# EAGLE design gpio_board (EAGLE 7.6.0)
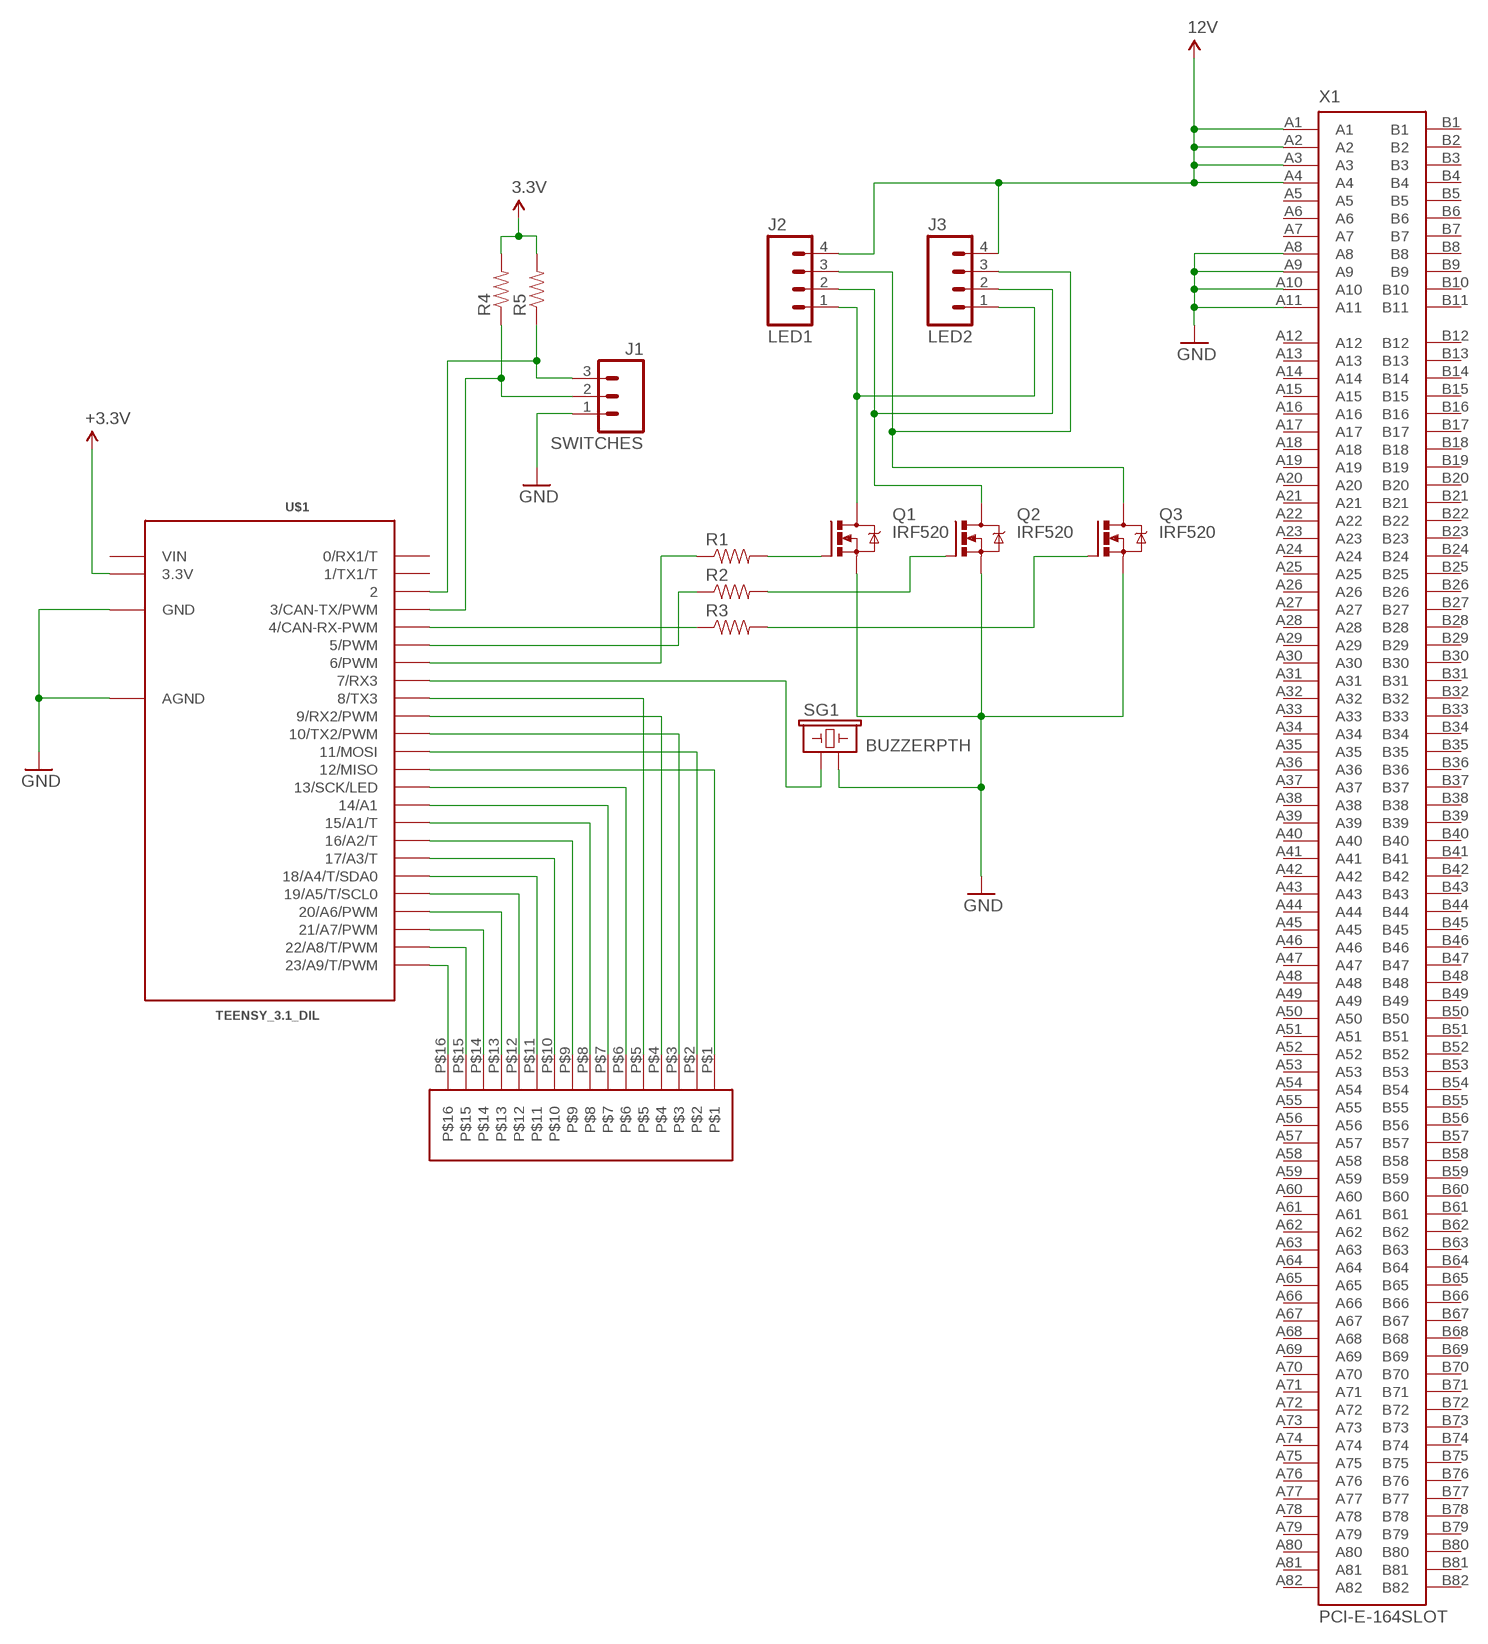
[diagram p0: schematic, sheet 1]

## Parts
J1  SWITCHES  M03PTH  [1X03]
J2  LED1  M04PTH  [1X04]
J3  LED2  M04PTH  [1X04]
Q1  IRF520  [TO220BV]
Q2  IRF520  [TO220BV]
Q3  IRF520  [TO220BV]
R1  RESISTOREZ  [AXIAL-0.3EZ]
R2  RESISTOREZ  [AXIAL-0.3EZ]
R3  RESISTOREZ  [AXIAL-0.3EZ]
R4  RESISTOREZ  [AXIAL-0.3EZ]
R5  RESISTOREZ  [AXIAL-0.3EZ]
SG1  BUZZERPTH  [BUZZER-12MM]
U$1  TEENSY_3.1_DIL  [TEENSY3-DIL]
U$2  PROTO_GRID  [PROTO_GRID16]
X1  PCI-E-164SLOT  [PCI-E_SLOT]

## Nets
3.3V: R4.P$2 R5.P$2
GND: J1.1 Q1.S Q2.S Q3.S SG1.- U$1.AGND U$1.GND X1.A8 X1.A9 X1.A10 X1.A11
N$1: Q1.G R1.P$2
N$2: Q2.G R2.P$2
N$3: Q3.G R3.P$2
N$4: J2.1 J3.1 Q1.D
N$5: J1.3 R5.P$1 U$1.2
N$6: J2.2 J3.2 Q2.D
N$7: J1.2 R4.P$1 U$1.3(3/CAN-TX/PWM)
N$8: R3.P$1 U$1.4(4/CAN-RX-PWM)
N$9: R2.P$1 U$1.5(5/PWM)
N$10: J2.3 J3.3 Q3.D
N$11: R1.P$1 U$1.6(6/PWM)
N$12: SG1.+ U$1.7(7/RX3)
N$13: U$1.8(8/TX3) U$2.P$5
N$14: U$1.23/A9(23/A9/T/PWM) U$2.P$16
N$15: U$1.22/A8(22/A8/T/PWM) U$2.P$15
N$16: U$1.21/A7(21/A7/PWM) U$2.P$14
N$17: U$1.20/A6(20/A6/PWM) U$2.P$13
N$18: U$1.19/A5(19/A5/T/SCL0) U$2.P$12
N$19: U$1.18/A4(18/A4/T/SDA0) U$2.P$11
N$20: U$1.17/A3(17/A3/T) U$2.P$10
N$21: U$1.16/A2(16/A2/T) U$2.P$9
N$22: U$1.15/A1(15/A1/T) U$2.P$8
N$23: U$1.14/A0(14/A1) U$2.P$7
N$24: U$1.13(13/SCK/LED) U$2.P$6
N$25: U$1.9(9/RX2/PWM) U$2.P$4
N$26: U$1.10(10/TX2/PWM) U$2.P$3
N$27: U$1.11(11/MOSI) U$2.P$2
N$28: U$1.12(12/MISO) U$2.P$1
VCC: J2.4 J3.4 U$1.3.3V X1.A1 X1.A2 X1.A3 X1.A4 ; supply symbol labelled +3.3V, 12V
Unconnected: U$1.0(0/RX1/T) U$1.1(1/TX1/T) X1.A5 X1.A6 X1.A7 X1.A12 X1.A13 X1.A14 X1.A15 X1.A16 X1.A17 X1.A18 X1.A19 X1.A20 X1.A21 X1.A22 X1.A23 X1.A24 X1.A25 X1.A26 X1.A27 X1.A28 X1.A29 X1.A30 X1.A31 X1.A32 X1.A33 X1.A34 X1.A35 X1.A36 X1.A37 X1.A38 X1.A39 X1.A40 X1.A41 X1.A42 X1.A43 X1.A44 X1.A45 X1.A46 X1.A47 X1.A48 X1.A49 X1.A50 X1.A51 X1.A52 X1.A53 X1.A54 X1.A55 X1.A56 X1.A57 X1.A58 X1.A59 X1.A60 X1.A61 X1.A62 X1.A63 X1.A64 X1.A65 X1.A66 X1.A67 X1.A68 X1.A69 X1.A70 X1.A71 X1.A72 X1.A73 X1.A74 X1.A75 X1.A76 X1.A77 X1.A78 X1.A79 X1.A80 X1.A81 X1.A82 X1.B1 X1.B2 X1.B3 X1.B4 X1.B5 X1.B6 X1.B7 X1.B8 X1.B9 X1.B10 X1.B11 X1.B12 X1.B13 X1.B14 X1.B15 X1.B16 X1.B17 X1.B18 X1.B19 X1.B20 X1.B21 X1.B22 X1.B23 X1.B24 X1.B25 X1.B26 X1.B27 X1.B28 X1.B29 X1.B30 X1.B31 X1.B32 X1.B33 X1.B34 X1.B35 X1.B36 X1.B37 X1.B38 X1.B39 X1.B40 X1.B41 X1.B42 X1.B43 X1.B44 X1.B45 X1.B46 X1.B47 X1.B48 X1.B49 X1.B50 X1.B51 X1.B52 X1.B53 X1.B54 X1.B55 X1.B56 X1.B57 X1.B58 X1.B59 X1.B60 X1.B61 X1.B62 X1.B63 X1.B64 X1.B65 X1.B66 X1.B67 X1.B68 X1.B69 X1.B70 X1.B71 X1.B72 X1.B73 X1.B74 X1.B75 X1.B76 X1.B77 X1.B78 X1.B79 X1.B80 X1.B81 X1.B82

## Power pins joined to a net without a drawn wire
VIN: U$1.VIN

## Library data of the parts
J1 = SparkFun-Connectors:M03: Header 3 Standard 3-pin 0.1" header. Use with straight break away headers (SKU : PRT-00116), right angle break away headers (PRT-00553), swiss pins (PRT-00743), machine pins (PRT-00117), and female headers (PRT-00115). Molex polarized connector foot print use with SKU : PRT-08232 with associated crimp pins and housings.
J2 J3 = SparkFun-Connectors:M04: Header 4 Standard 4-pin 0.1" header. Use with straight break away headers (SKU : PRT-00116), right angle break away headers (PRT-00553), swiss pins (PRT-00743), machine pins (PRT-00117), and female headers (PRT-00115). Molex polarized connector foot print use with SKU : PRT-08231 with associated crimp pins and housings. 1MM SMD Version SKU: PRT-10208; PROD_ID: CONN-09696
Q1-Q3 = transistor-power:IRF520: HEXFET Power MOSFET
R1-R5 = SparkFun-Passives:RESISTOR: Resistor Basic schematic elements and footprints for 0603, 1206, and PTH resistors.
SG1 = SparkFun-Electromechanical:BUZZER: Buzzer 12mm Spark Fun Electronics SKU : Comp-Buzzer
U$1 = Teensy_3_and_LC_Series_Boards_v1.1:TEENSY_3.1_DIL: Teensy 3.1 or 3.2 in a DIL Layout.
U$2 = talon_lbr:PROTO_GRID
X1 = con-pc:PCI-E-164: Copy from con-pci_express(pci-e).lbr uploaded Mon Jul 2 10:15:25 2007 Library for PCI-Express x16 (PCI-E) connector. Includes connector and card edge pattern. Uploaded by JF Duval <jfduval@aqra.ca> from AQRA.ca

## Board
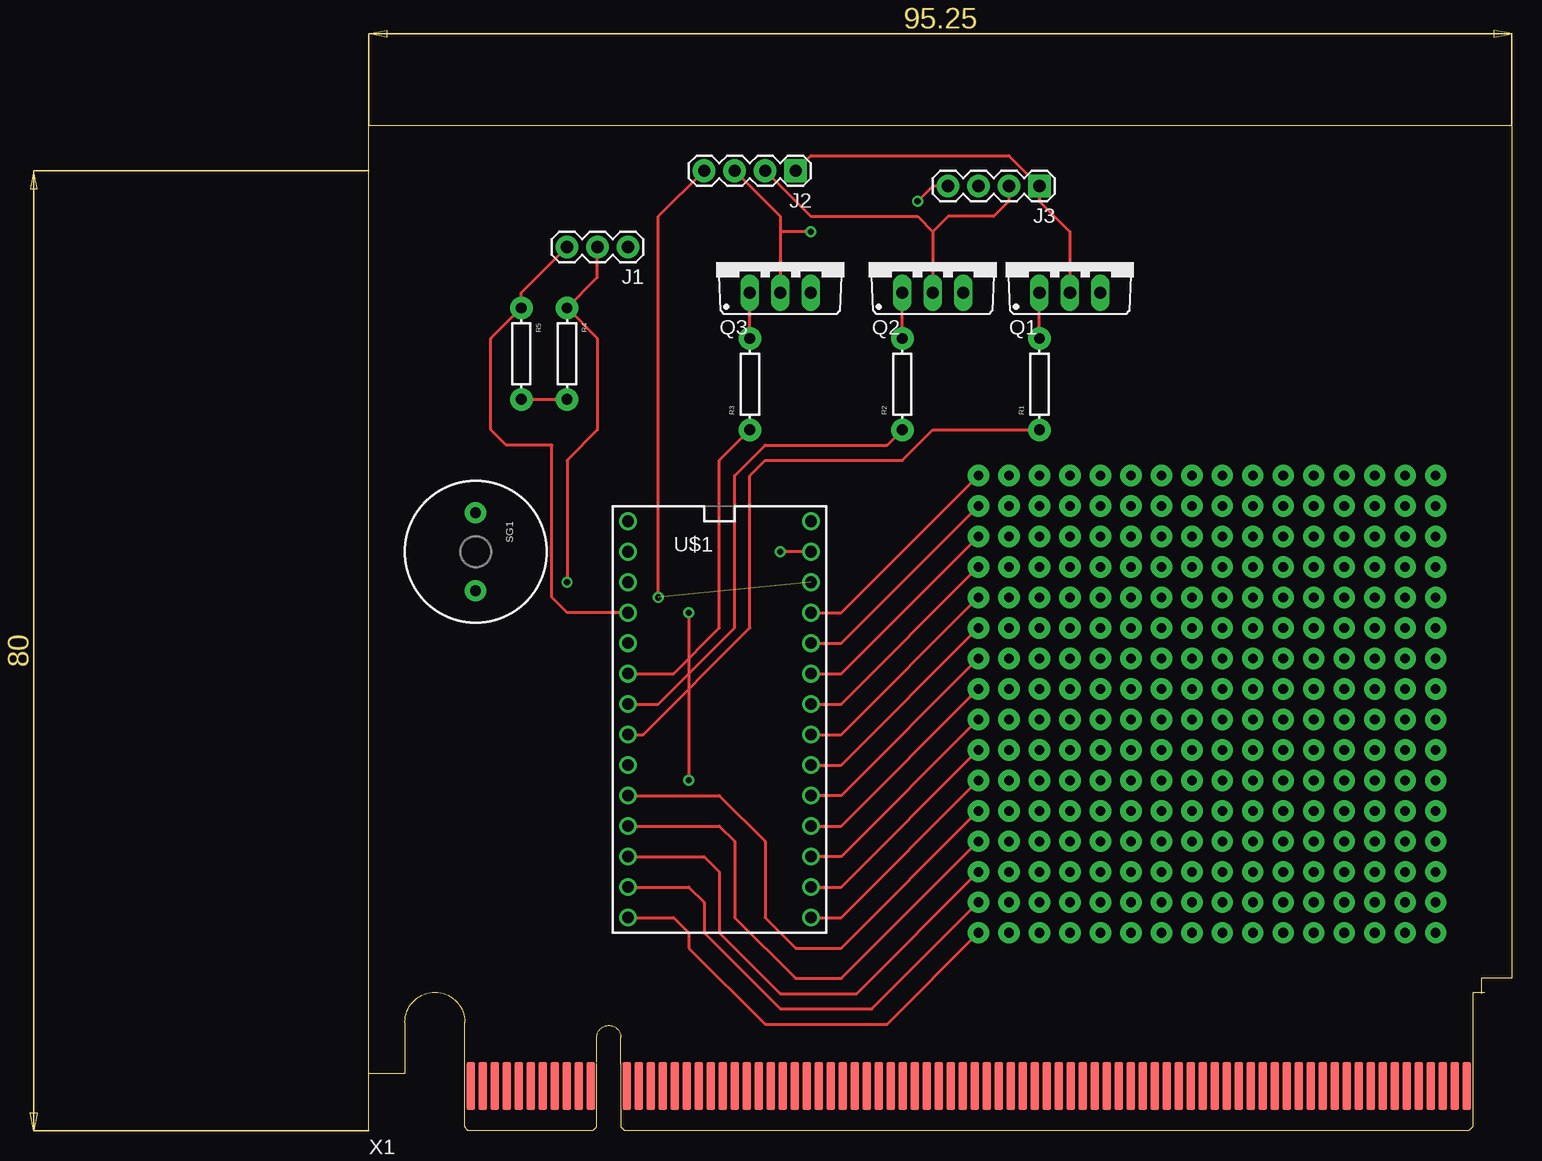
[diagram p1: board, top side]
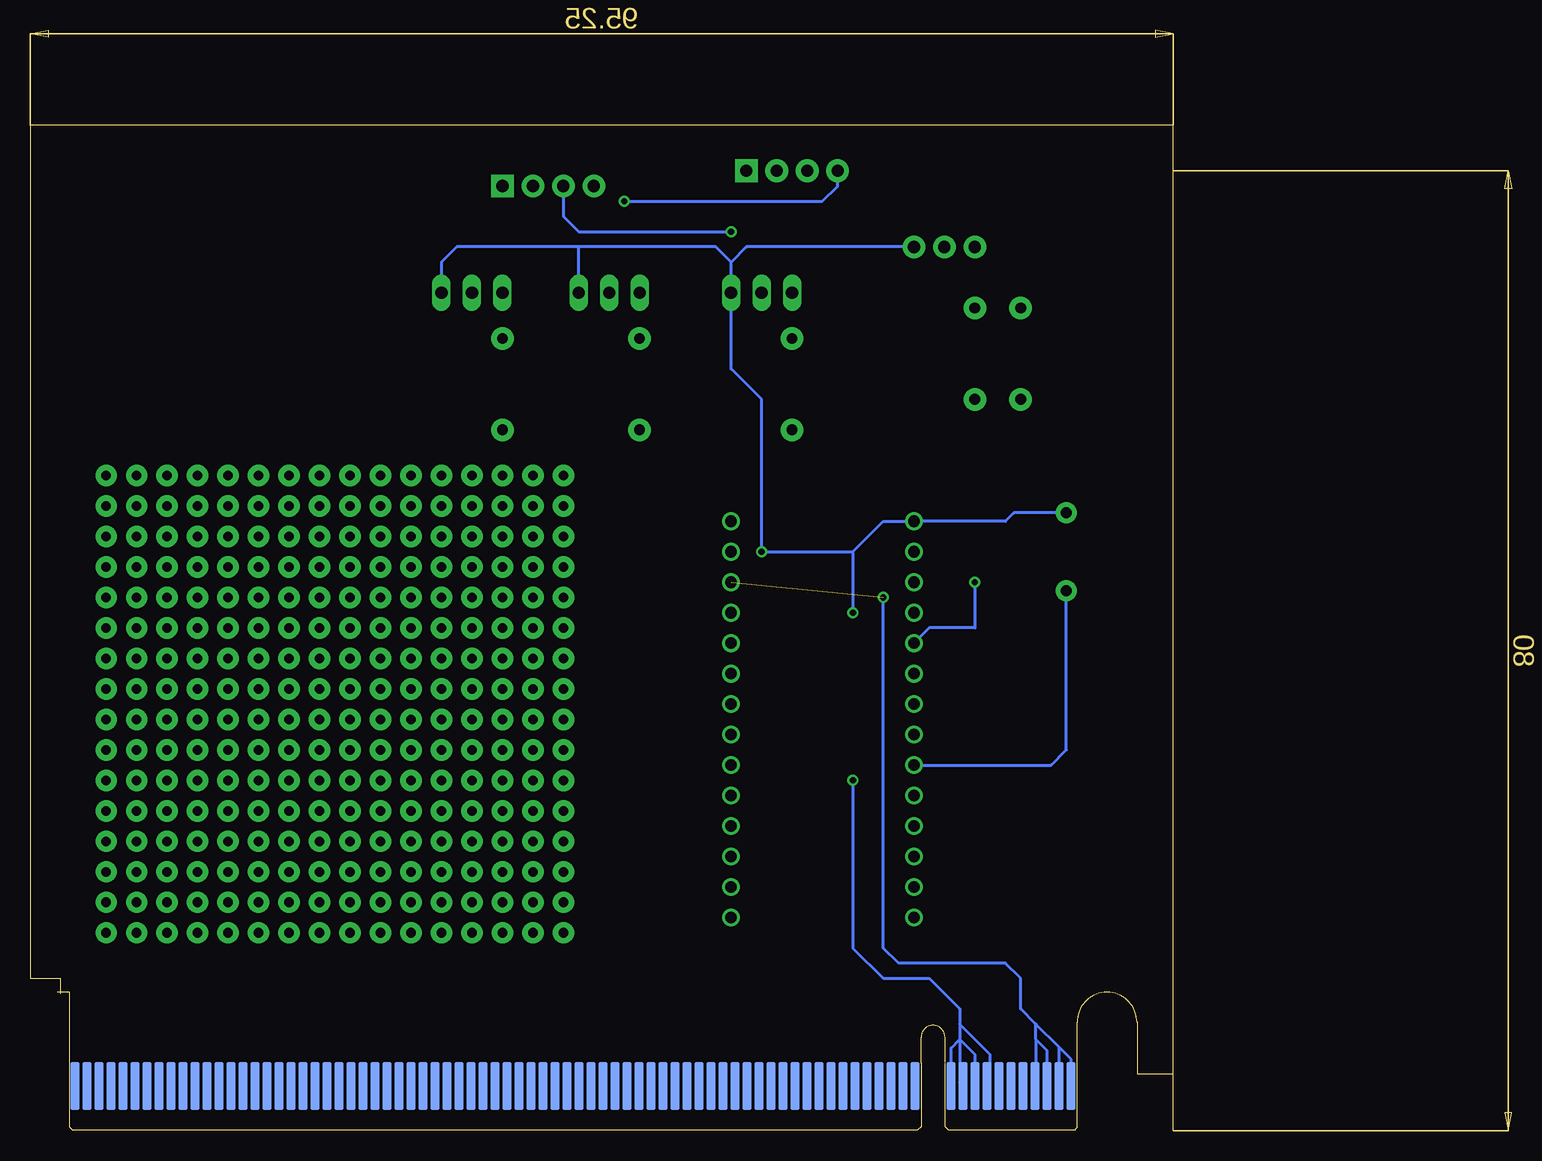
[diagram p2: board, bottom side, seen from below]

Size 95.25 x 83.82 mm. Coordinates in mm from the lower left corner, seen from the top.
Outline: 0,0 0,80
Outline: 0,80.01 0,83.82 95.25,83.82 95.25,12.7 92.71,12.7 92.71,11.43
Copper layers (1*16): Top 0.035mm / dielectric 1.5mm / Bottom 0.035mm
Design rules "default": minimum track width 10mil, minimum drill 24mil, track to track 8mil, track to pad 8mil, pad to pad 8mil, via to via 8mil, smd to smd 8mil, copper to edge 40mil, drill to drill 8mil, minimum pad ring 10mil, minimum via ring 8mil, stop-mask expansion 4mil, vias tented up to drill 0mil, thermal gap 10mil

### Footprints (pad centres in the part's own frame; a part is rotated, then mirrored left to right if it is on the bottom)
1X03 = drill 1.016 pad 1.88: 1 0,0; 2 2.54,0; 3 5.08,0
1X04 = drill 1.016 pad 1.88 square: 1 0,0 | drill 1.016 pad 1.88: 2 2.54,0; 3 5.08,0; 4 7.62,0
TO220BV = drill 1.016 long: D 0,-2.54; G -2.54,-2.54; S 2.54,-2.54
AXIAL-0.3EZ = drill 0.9 pad 1.88: P$1 -3.81,0; P$2 3.81,0
BUZZER-12MM = drill 0.9 pad 1.778: + 3.25,0; - -3.25,0
TEENSY3-DIL = drill 0.965: 0 -7.62,13.97; 1 -7.62,11.43; 2 -7.62,8.89; 3 -7.62,6.35; 3.3V 7.62,11.43; 4 -7.62,3.81; 5 -7.62,1.27; 6 -7.62,-1.27; 7 -7.62,-3.81; 8 -7.62,-6.35; 9 -7.62,-8.89; 10 -7.62,-11.43; 11 -7.62,-13.97; 12 -7.62,-16.51; 13 7.62,-16.51; 14/A0 7.62,-13.97; 15/A1 7.62,-11.43; 16/A2 7.62,-8.89; 17/A3 7.62,-6.35; 18/A4 7.62,-3.81; 19/A5 7.62,-1.27; 20/A6 7.62,1.27; 21/A7 7.62,3.81; 22/A8 7.62,6.35; 23/A9 7.62,8.89; AGND 7.62,13.97; GND -7.62,16.51; VIN 7.62,16.51
PROTO_GRID16 = drill 0.8 pad 1.778: P$1 0,38.1; P$2 0,35.56; P$3 0,33.02; P$4 0,30.48; P$5 0,27.94; P$6 0,25.4; P$7 0,22.86; P$8 0,20.32; P$9 0,17.78; P$10 0,15.24; P$11 0,12.7; P$12 0,10.16; P$13 0,7.62; P$14 0,5.08; P$15 0,2.54; P$16 0,0; P$17 2.54,38.1; P$18 2.54,35.56; P$19 2.54,33.02; P$20 2.54,30.48; P$21 2.54,27.94; P$22 2.54,25.4; P$23 2.54,22.86; P$24 2.54,20.32; P$25 2.54,0; P$26 2.54,2.54; P$27 2.54,5.08; P$28 2.54,7.62; P$29 2.54,10.16; P$30 2.54,12.7; P$31 2.54,15.24; P$32 2.54,17.78; P$33 7.62,38.1; P$34 7.62,35.56; P$35 7.62,33.02; P$36 7.62,30.48; P$37 7.62,27.94; P$38 7.62,25.4; P$39 7.62,22.86; P$40 7.62,20.32; P$41 5.08,38.1; P$42 5.08,35.56; P$43 5.08,33.02; P$44 5.08,30.48; P$45 5.08,27.94; P$46 5.08,25.4; P$47 5.08,22.86; P$48 5.08,20.32; P$49 5.08,17.78; P$50 5.08,15.24; P$51 5.08,12.7; P$52 5.08,10.16; P$53 5.08,7.62; P$54 5.08,5.08; P$55 5.08,2.54; P$56 5.08,0; P$57 7.62,0; P$58 7.62,2.54; P$59 7.62,5.08; P$60 7.62,7.62; P$61 7.62,10.16; P$62 7.62,12.7; P$63 7.62,15.24; P$64 7.62,17.78; P$65 12.7,38.1; P$66 12.7,35.56; P$67 12.7,33.02; P$68 12.7,30.48; P$69 12.7,27.94; P$70 12.7,25.4; P$71 12.7,22.86; P$72 12.7,20.32; P$73 10.16,38.1; P$74 10.16,35.56; P$75 10.16,33.02; P$76 10.16,30.48; P$77 10.16,27.94; P$78 10.16,25.4; P$79 10.16,22.86; P$80 10.16,20.32; P$81 10.16,17.78; P$82 10.16,15.24; P$83 10.16,12.7; P$84 10.16,10.16; P$85 10.16,7.62; P$86 10.16,5.08; P$87 10.16,2.54; P$88 10.16,0; P$89 12.7,0; P$90 12.7,2.54; P$91 12.7,5.08; P$92 12.7,7.62; P$93 12.7,10.16; P$94 12.7,12.7; P$95 12.7,15.24; P$96 12.7,17.78; P$97 17.78,38.1; P$98 17.78,35.56; P$99 17.78,33.02; P$100 17.78,30.48; P$101 17.78,27.94; P$102 17.78,25.4; P$103 17.78,22.86; P$104 17.78,20.32; P$105 15.24,38.1; P$106 15.24,35.56; P$107 15.24,33.02; P$108 15.24,30.48; P$109 15.24,27.94; P$110 15.24,25.4; P$111 15.24,22.86; P$112 15.24,20.32; P$113 15.24,17.78; P$114 15.24,15.24; P$115 15.24,12.7; P$116 15.24,10.16; P$117 15.24,7.62; P$118 15.24,5.08; P$119 15.24,2.54; P$120 15.24,0; P$121 17.78,0; P$122 17.78,2.54; P$123 17.78,5.08; P$124 17.78,7.62; P$125 17.78,10.16; P$126 17.78,12.7; P$127 17.78,15.24; P$128 17.78,17.78; P$129 22.86,38.1; P$130 22.86,35.56; P$131 22.86,33.02; P$132 22.86,30.48; P$133 22.86,27.94; P$134 22.86,25.4; P$135 22.86,22.86; P$136 22.86,20.32; P$137 20.32,38.1; P$138 20.32,35.56; P$139 20.32,33.02; P$140 20.32,30.48; P$141 20.32,27.94; P$142 20.32,25.4; P$143 20.32,22.86; P$144 20.32,20.32; P$145 20.32,17.78; P$146 20.32,15.24; P$147 20.32,12.7; P$148 20.32,10.16; P$149 20.32,7.62; P$150 20.32,5.08; P$151 20.32,2.54; P$152 20.32,0; P$153 22.86,0; P$154 22.86,2.54; P$155 22.86,5.08; P$156 22.86,7.62; P$157 22.86,10.16; P$158 22.86,12.7; P$159 22.86,15.24; P$160 22.86,17.78; P$161 27.94,38.1; P$162 27.94,35.56; P$163 27.94,33.02; P$164 27.94,30.48; P$165 27.94,27.94; P$166 27.94,25.4; P$167 27.94,22.86; P$168 27.94,20.32; P$169 25.4,38.1; P$170 25.4,35.56; P$171 25.4,33.02; P$172 25.4,30.48; P$173 25.4,27.94; P$174 25.4,25.4; P$175 25.4,22.86; P$176 25.4,20.32; P$177 25.4,17.78; P$178 25.4,15.24; P$179 25.4,12.7; P$180 25.4,10.16; P$181 25.4,7.62; P$182 25.4,5.08; P$183 25.4,2.54; P$184 25.4,0; P$185 27.94,0; P$186 27.94,2.54; P$187 27.94,5.08; P$188 27.94,7.62; P$189 27.94,10.16; P$190 27.94,12.7; P$191 27.94,15.24; P$192 27.94,17.78; P$193 33.02,38.1; P$194 33.02,35.56; P$195 33.02,33.02; P$196 33.02,30.48; P$197 33.02,27.94; P$198 33.02,25.4; P$199 33.02,22.86; P$200 33.02,20.32; P$201 30.48,38.1; P$202 30.48,35.56; P$203 30.48,33.02; P$204 30.48,30.48; P$205 30.48,27.94; P$206 30.48,25.4; P$207 30.48,22.86; P$208 30.48,20.32; P$209 30.48,17.78; P$210 30.48,15.24; P$211 30.48,12.7; P$212 30.48,10.16; P$213 30.48,7.62; P$214 30.48,5.08; P$215 30.48,2.54; P$216 30.48,0; P$217 33.02,0; P$218 33.02,2.54; P$219 33.02,5.08; P$220 33.02,7.62; P$221 33.02,10.16; P$222 33.02,12.7; P$223 33.02,15.24; P$224 33.02,17.78; P$225 38.1,38.1; P$226 38.1,35.56; P$227 38.1,33.02; P$228 38.1,30.48; P$229 38.1,27.94; P$230 38.1,25.4; P$231 38.1,22.86; P$232 38.1,20.32; P$233 35.56,38.1; P$234 35.56,35.56; P$235 35.56,33.02; P$236 35.56,30.48; P$237 35.56,27.94; P$238 35.56,25.4; P$239 35.56,22.86; P$240 35.56,20.32; P$241 35.56,17.78; P$242 35.56,15.24; P$243 35.56,12.7; P$244 35.56,10.16; P$245 35.56,7.62; P$246 35.56,5.08; P$247 35.56,2.54; P$248 35.56,0; P$249 38.1,0; P$250 38.1,2.54; P$251 38.1,5.08; P$252 38.1,7.62; P$253 38.1,10.16; P$254 38.1,12.7; P$255 38.1,15.24; P$256 38.1,17.78
PCI-E_SLOT = smd 0.7 x 4 bottom: A1 8.5,3.75; A2 9.5,3.75; A3 10.5,3.75; A4 11.5,3.75; A5 12.5,3.75; A6 13.5,3.75; A7 14.5,3.75; A8 15.5,3.75; A9 16.5,3.75; A10 17.5,3.75; A11 18.5,3.75; A12 21.5,3.75; A13 22.5,3.75; A14 23.5,3.75; A15 24.5,3.75; A16 25.5,3.75; A17 26.5,3.75; A18 27.5,3.75; A19 28.5,3.75; A20 29.5,3.75; A21 30.5,3.75; A22 31.5,3.75; A23 32.5,3.75; A24 33.5,3.75; A25 34.5,3.75; A26 35.5,3.75; A27 36.5,3.75; A28 37.5,3.75; A29 38.5,3.75; A30 39.5,3.75; A31 40.5,3.75; A32 41.5,3.75; A33 42.5,3.75; A34 43.5,3.75; A35 44.5,3.75; A36 45.5,3.75; A37 46.5,3.75; A38 47.5,3.75; A39 48.5,3.75; A40 49.5,3.75; A41 50.5,3.75; A42 51.5,3.75; A43 52.5,3.75; A44 53.5,3.75; A45 54.5,3.75; A46 55.5,3.75; A47 56.5,3.75; A48 57.5,3.75; A49 58.5,3.75; A50 59.5,3.75; A51 60.5,3.75; A52 61.5,3.75; A53 62.5,3.75; A54 63.5,3.75; A55 64.5,3.75; A56 65.5,3.75; A57 66.5,3.75; A58 67.5,3.75; A59 68.5,3.75; A60 69.5,3.75; A61 70.5,3.75; A62 71.5,3.75; A63 72.5,3.75; A64 73.5,3.75; A65 74.5,3.75; A66 75.5,3.75; A67 76.5,3.75; A68 77.5,3.75; A69 78.5,3.75; A70 79.5,3.75; A71 80.5,3.75; A72 81.5,3.75; A73 82.5,3.75; A74 83.5,3.75; A75 84.5,3.75; A76 85.5,3.75; A77 86.5,3.75; A78 87.5,3.75; A79 88.5,3.75; A80 89.5,3.75; A81 90.5,3.75; A82 91.5,3.75 | smd 0.7 x 4: B1 8.5,3.75; B2 9.5,3.75; B3 10.5,3.75; B4 11.5,3.75; B5 12.5,3.75; B6 13.5,3.75; B7 14.5,3.75; B8 15.5,3.75; B9 16.5,3.75; B10 17.5,3.75; B11 18.5,3.75; B12 21.5,3.75; B13 22.5,3.75; B14 23.5,3.75; B15 24.5,3.75; B16 25.5,3.75; B17 26.5,3.75; B18 27.5,3.75; B19 28.5,3.75; B20 29.5,3.75; B21 30.5,3.75; B22 31.5,3.75; B23 32.5,3.75; B24 33.5,3.75; B25 34.5,3.75; B26 35.5,3.75; B27 36.5,3.75; B28 37.5,3.75; B29 38.5,3.75; B30 39.5,3.75; B31 40.5,3.75; B32 41.5,3.75; B33 42.5,3.75; B34 43.5,3.75; B35 44.5,3.75; B36 45.5,3.75; B37 46.5,3.75; B38 47.5,3.75; B39 48.5,3.75; B40 49.5,3.75; B41 50.5,3.75; B42 51.5,3.75; B43 52.5,3.75; B44 53.5,3.75; B45 54.5,3.75; B46 55.5,3.75; B47 56.5,3.75; B48 57.5,3.75; B49 58.5,3.75; B50 59.5,3.75; B51 60.5,3.75; B52 61.5,3.75; B53 62.5,3.75; B54 63.5,3.75; B55 64.5,3.75; B56 65.5,3.75; B57 66.5,3.75; B58 67.5,3.75; B59 68.5,3.75; B60 69.5,3.75; B61 70.5,3.75; B62 71.5,3.75; B63 72.5,3.75; B64 73.5,3.75; B65 74.5,3.75; B66 75.5,3.75; B67 76.5,3.75; B68 77.5,3.75; B69 78.5,3.75; B70 79.5,3.75; B71 80.5,3.75; B72 81.5,3.75; B73 82.5,3.75; B74 83.5,3.75; B75 84.5,3.75; B76 85.5,3.75; B77 86.5,3.75; B78 87.5,3.75; B79 88.5,3.75; B80 89.5,3.75; B81 90.5,3.75; B82 91.5,3.75

### Placement (x,y rotation side)
J1  21.59,73.66 180 top
J2  35.56,80.01 180 top
J3  55.88,78.74 180 top
Q1  58.42,72.39 0 top
Q2  46.99,72.39 0 top
Q3  34.29,72.39 0 top
R1  55.88,62.23 90 top
R2  44.45,62.23 90 top
R3  31.75,62.23 90 top
R4  16.51,64.77 270 top
R5  12.7,64.77 270 top
SG1  8.89,48.26 270 top
U$1  29.21,34.29 0 top
U$2  50.8,54.61 180 bottom
X1  0,0 0 top

### Tracks (layer width: path | path; a pad name or v marks a point on that pad's centre or on a via)
3.3V
  Top 0.254: R5.P$2 R4.P$2
GND  (via drill 0.51)
  Top 0.254: U$1.AGND v34.29,48.26 | v26.67,43.18 v26.67,29.21
  Bottom 0.254: 26.67,48.26 v34.29,48.26 34.29,60.96 36.83,63.5 Q3.S 36.83,72.39 | 26.67,48.26 24.13,50.8 U$1.GND 13.97,50.8 13.26,51.51 SG1.- | 36.83,72.39 38.1,73.66 49.53,73.66 | 49.53,73.66 59.69,73.66 60.96,72.39 Q1.S | Q2.S 49.53,73.66 | J1.1 35.56,73.66 36.83,72.39 | 26.67,48.26 v26.67,43.18 | v26.67,29.21 26.67,15.24 24.13,12.7 20.32,12.7 17.78,10.16 17.78,8.89 | 17.78,8.89 17.78,7.62 | 17.78,7.62 17.78,4.03 X1.A10 | X1.A9 16.5,6.34 17.78,7.62 | X1.A8 15.3,3.75 15.24,3.81 15.24,6.35 17.78,8.89 | X1.A11 18.5,6.9 17.78,7.62
N$1
  Top 0.254: R1.P$2 Q1.G
N$2
  Top 0.254: R2.P$2 Q2.G
N$3
  Top 0.254: R3.P$2 Q3.G
N$4
  Top 0.254: Q1.D 58.42,74.93 55.88,77.47 J3.1 53.34,81.28 36.83,81.28 J2.1
N$5
  Top 0.254: U$1.2 16.51,43.18 15.24,44.45 15.24,57.15 11.43,57.15 10.16,58.42 10.16,66.04 R5.P$1 12.7,69.85 J1.3
N$6
  Top 0.254: J2.2 36.83,76.2 45.72,76.2 46.99,74.93 | 46.99,74.93 Q2.D | J3.2 53.34,77.47 52.07,76.2 48.26,76.2 46.99,74.93
N$7  (via drill 0.51)
  Top 0.254: v16.51,45.72 16.51,55.88 19.05,58.42 19.05,66.04 R4.P$1 19.05,71.12 J1.2
  Bottom 0.254: v16.51,45.72 16.51,41.91 20.32,41.91 U$1.3
N$8
  Top 0.254: U$1.4 25.4,38.1 29.21,41.91 29.21,55.88 R3.P$1
N$9
  Top 0.254: U$1.5 24.13,35.56 30.48,41.91 30.48,54.61 33.02,57.15 43.18,57.15 R2.P$1
N$10  (via drill 0.51)
  Top 0.254: J2.3 34.29,76.2 34.29,74.93 | 34.29,74.93 Q3.D | v36.83,74.93 34.29,74.93
  Bottom 0.254: J3.3 50.8,76.2 49.53,74.93 v36.83,74.93
N$11
  Top 0.254: U$1.6 22.86,33.02 31.75,41.91 31.75,54.61 33.02,55.88 44.45,55.88 46.99,58.42 R1.P$1
N$12
  Bottom 0.254: U$1.7 10.16,30.48 8.89,31.75 SG1.+
N$13
  Top 0.254: U$1.8 29.21,27.94 33.02,24.13 33.02,17.78 35.56,15.24 39.37,15.24 U$2.P$5
N$14
  Top 0.254: U$1.23/A9 39.37,43.18 U$2.P$16
N$15
  Top 0.254: U$1.22/A8 39.37,40.64 U$2.P$15
N$16
  Top 0.254: U$1.21/A7 39.37,38.1 U$2.P$14
N$17
  Top 0.254: U$1.20/A6 39.37,35.56 U$2.P$13
N$18
  Top 0.254: U$1.19/A5 39.37,33.02 U$2.P$12
N$19
  Top 0.254: U$1.18/A4 39.37,30.48 U$2.P$11
N$20
  Top 0.254: U$2.P$10 39.37,27.94 U$1.17/A3
N$21
  Top 0.254: U$1.16/A2 39.37,25.4 U$2.P$9
N$22
  Top 0.254: U$2.P$8 39.37,22.86 U$1.15/A1
N$23
  Top 0.254: U$1.14/A0 39.37,20.32 U$2.P$7
N$24
  Top 0.254: U$1.13 39.37,17.78 U$2.P$6
N$25
  Top 0.254: U$1.9 29.21,25.4 30.48,24.13 30.48,17.78 35.56,12.7 39.37,12.7 U$2.P$4
N$26
  Top 0.254: U$1.10 27.94,22.86 29.21,21.59 29.21,16.51 34.29,11.43 40.64,11.43 U$2.P$3
N$27
  Top 0.254: U$2.P$2 41.91,10.16 34.29,10.16 27.94,16.51 27.94,19.05 26.67,20.32 U$1.11
N$28
  Top 0.254: U$2.P$1 43.18,8.89 33.02,8.89 26.67,15.24 26.67,16.51 25.4,17.78 U$1.12
VCC  (via drill 0.51)  (1 unrouted)
  Top 0.254: v24.13,44.45 24.13,76.2 J2.4 | J3.4 46.99,78.74 v45.72,77.47
  Bottom 0.254: 11.56,3.81 X1.A4 11.43,3.82 11.43,7.62 | 11.43,7.62 11.43,8.89 | 11.43,8.89 12.7,10.16 12.7,12.7 13.97,13.97 22.86,13.97 24.13,15.24 v24.13,44.45 | X1.A3 10.5,6.69 11.43,7.62 | X1.A2 9.5,6.96 | 9.5,6.96 11.43,8.89 | X1.A1 8.5,5.96 9.5,6.96 | v45.72,77.47 29.21,77.47 27.94,78.74 J2.4